# EasyEDA schematic SCH_Encoder.json
TITLE: Sheet_1; REV: 1.0; Date: 2021-01-13; Sheet: 1/1; Drawn By: MUSHIBO
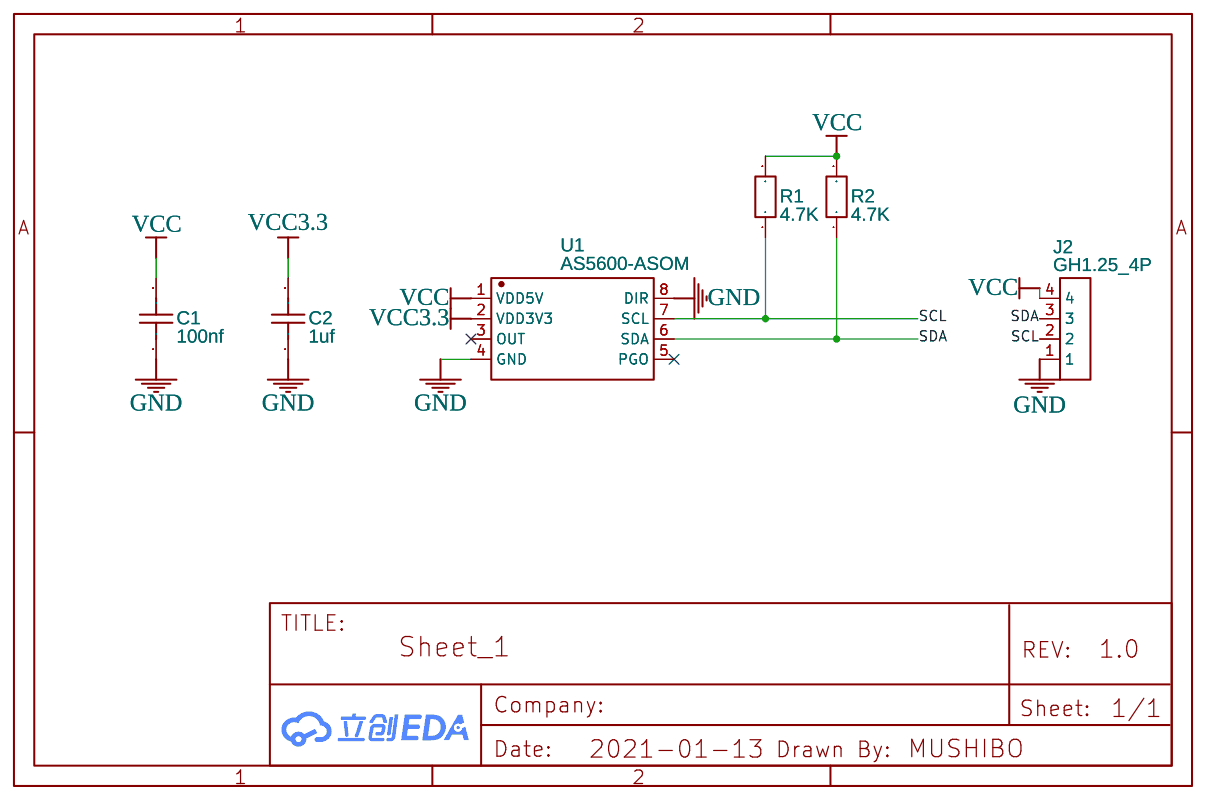
[diagram p0: schematic sheet]

## Parts
C1  100nf  [C0603]
C2  1uf  [C0603]
J2  GH1.25_4P  [GH1.25_4P_卧贴]
R1  4.7K  [R0603]
R2  4.7K  [R0603]
U1  AS5600-ASOM  [SOIC-8_L5.0-W4.0-P1.27-LS6.0-BL]

## Library data of the parts
C1 C2 = C_0603_US: Contributor: LCEDA_Lib
J2 = GH1.25_4P: Manufacturer: Changjiang Connectors; Supplier: LCSC; Supplier Part: CC225131; Contributor: tianxiangv
R1 R2 = R_0603_EU: Contributor: LCEDA_Lib
U1 = AS5600-ASOM: Supplier: LCSC; Manufacturer: Ams; Supplier Part: C79815; SMT Type: Extend; JLCPCB SMD: Yes; JLCPCB Part Class: Extended Part

## Nets
GND: C1.1 C2.1 J2.1 U1.4(GND) U1.8(DIR)
VCC: C1.2 J2.4 R1.2 R2.2 U1.1(VDD5V)
VCC3.3: C2.2 U1.2(VDD3V3)
SCL: J2.2 R1.1 U1.7(SCL)
SDA: J2.3 R2.1 U1.6(SDA)

Not connected (* = marked no-connect by the designer): U1 3(OUT)* 5(PGO)*
